# Altium schematic sheet CPLD.SchDoc: {Наименование}
size 420 x 297 mm; DocumentNumber: НРДЦ.ХХХХХХ.ХХХ ХХ; SheetNumber: {}; SheetTotal: {}; PageSetup: Record=PageOptions|CenterHorizontal=False|CenterVertical=False|PrintScale=0.95|XCorrection=0.00|YCorrection=0.00|PrintKind=1|BorderSize=5000000|LeftOffset=0|BottomOffset=0|Orientation=1|PaperLength=1000|PaperWidth=1000|Scale=100|PaperSource=15|PrintQuality=600|MediaType=1|DitherType=10|PaperKind=A4|PrintScaleMode=1; Rule: PcbType=ProtelPcb
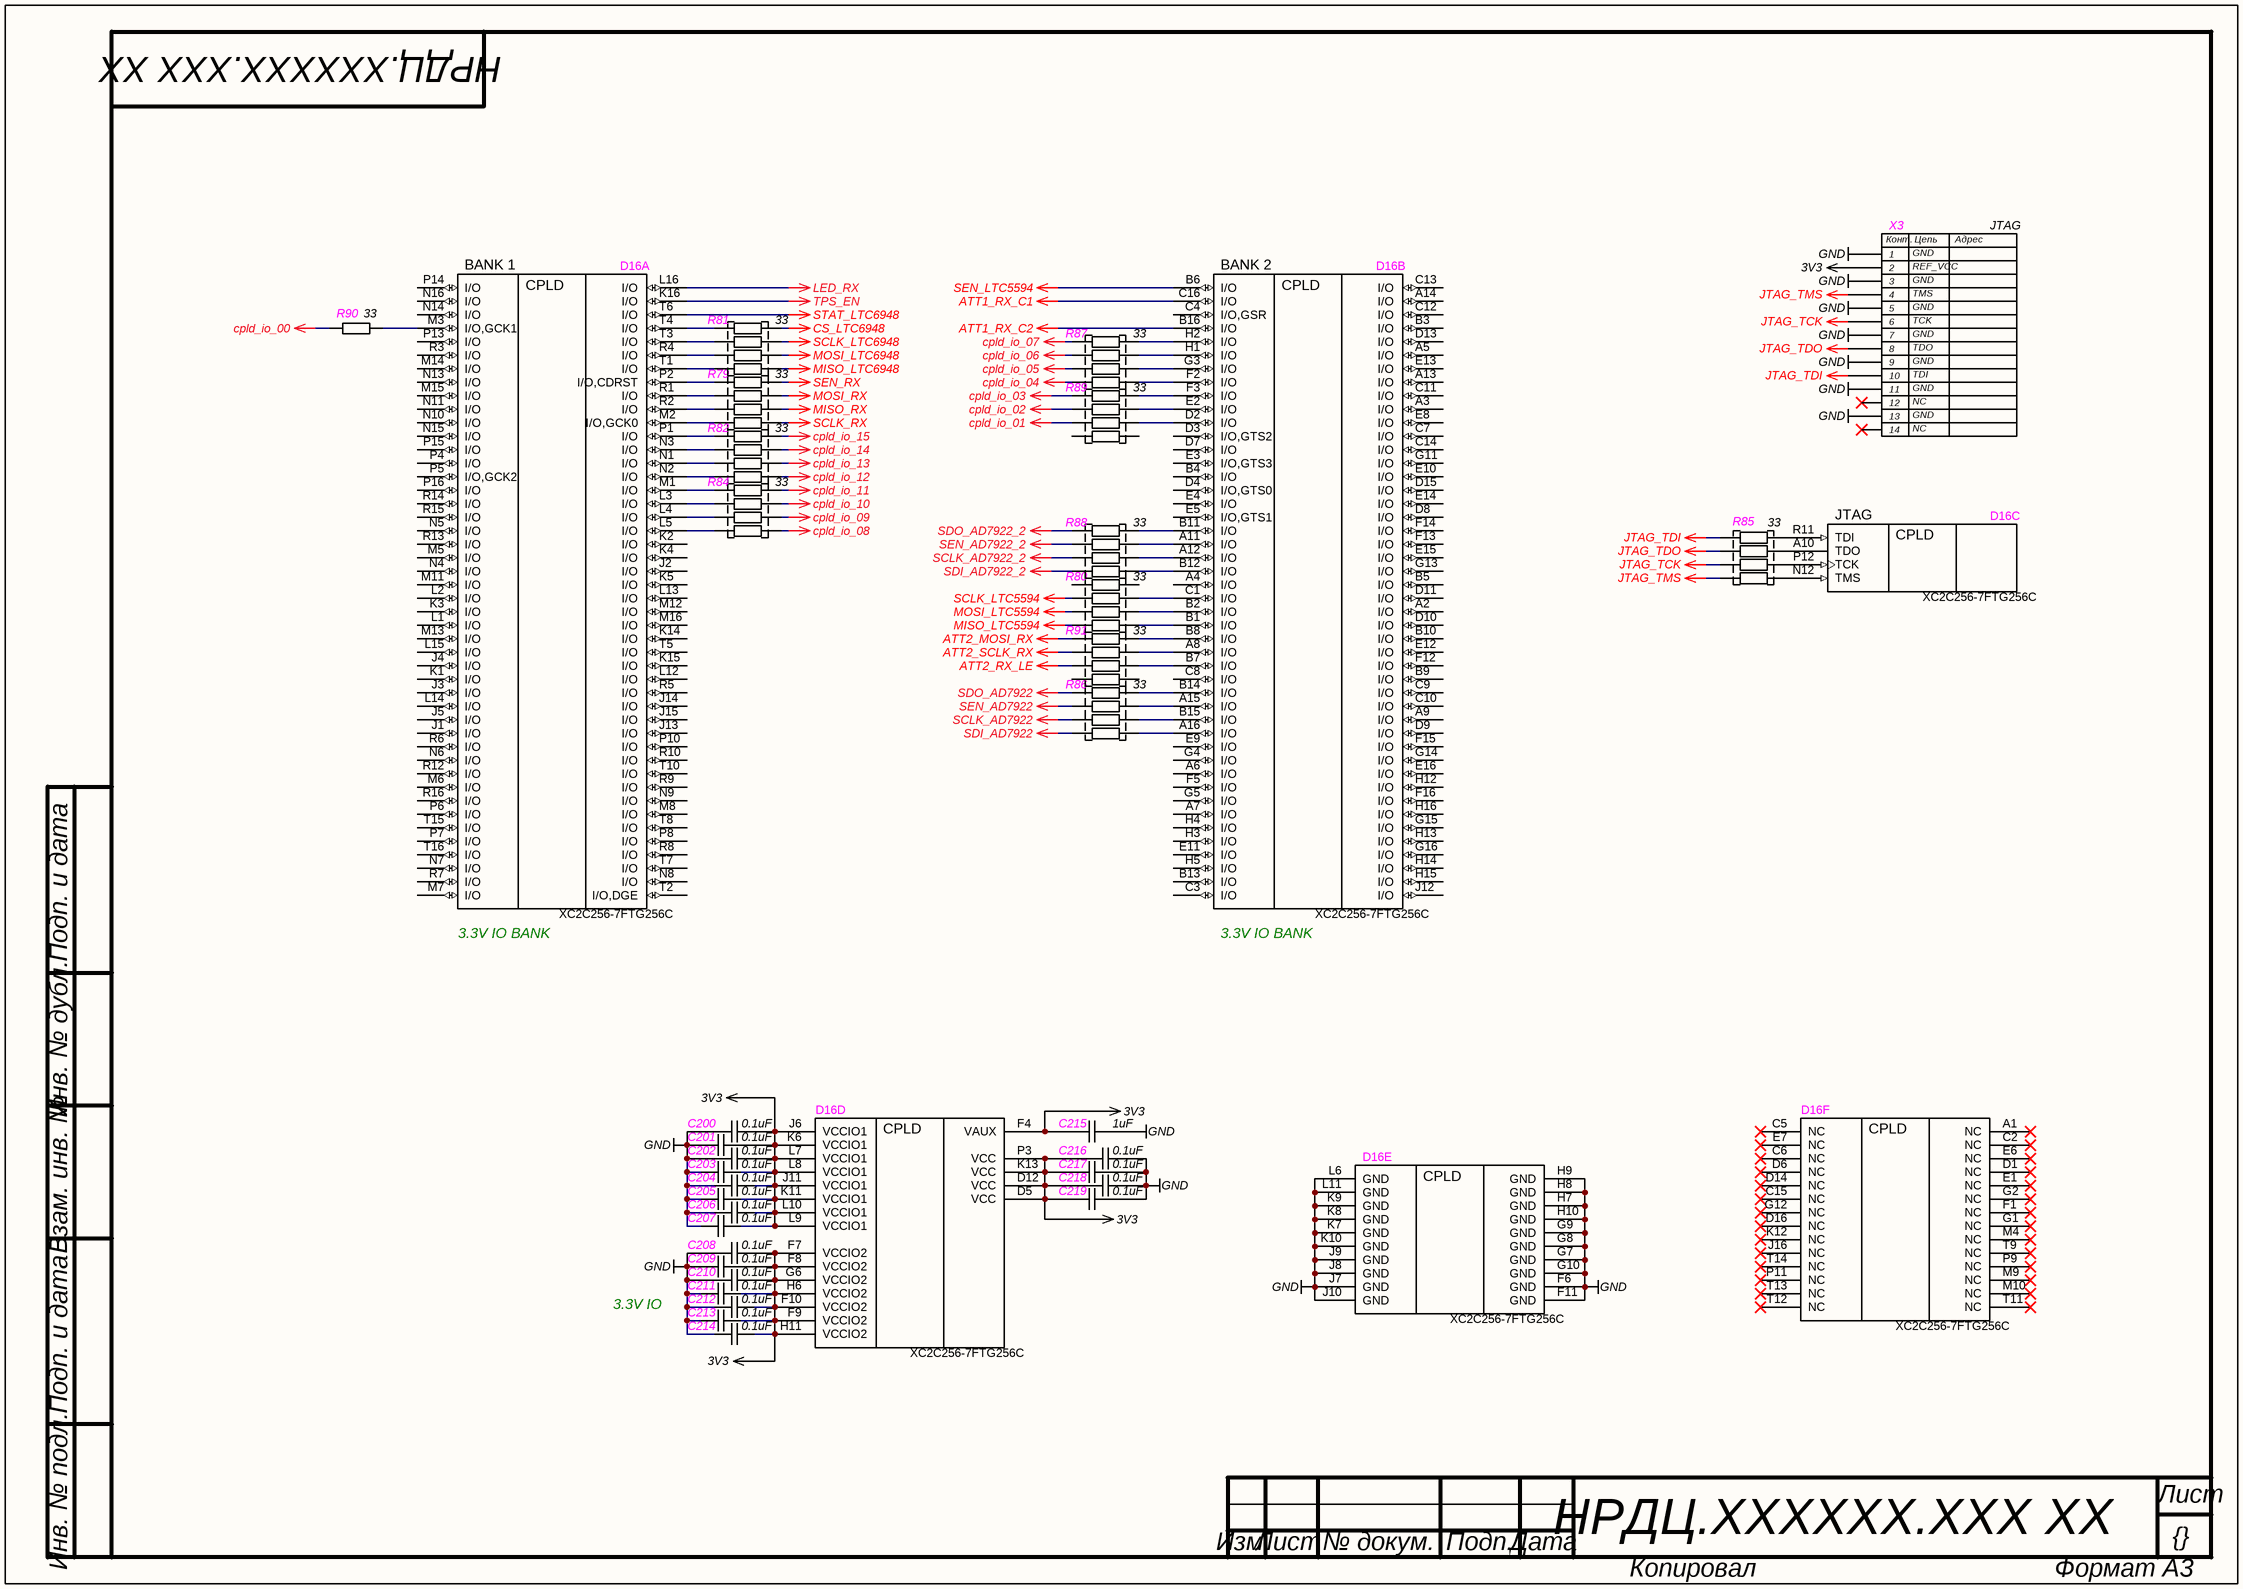
[diagram p0: CPLD.SchDoc]

## Parts
C200  value 0.1uF  [C0402]  (hidden comment: CAP)
C201  value 0.1uF  [C0402]  (hidden comment: CAP)
C202  value 0.1uF  [C0402]  (hidden comment: CAP)
C203  value 0.1uF  [C0402]  (hidden comment: CAP)
C204  value 0.1uF  [C0402]  (hidden comment: CAP)
C205  value 0.1uF  [C0402]  (hidden comment: CAP)
C206  value 0.1uF  [C0402]  (hidden comment: CAP)
C207  value 0.1uF  [C0402]  (hidden comment: CAP)
C208  value 0.1uF  [C0402]  (hidden comment: CAP)
C209  value 0.1uF  [C0402]  (hidden comment: CAP)
C210  value 0.1uF  [C0402]  (hidden comment: CAP)
C211  value 0.1uF  [C0402]  (hidden comment: CAP)
C212  value 0.1uF  [C0402]  (hidden comment: CAP)
C213  value 0.1uF  [C0402]  (hidden comment: CAP)
C214  value 0.1uF  [C0402]  (hidden comment: CAP)
C215  value 1uF  [C0402]  (hidden comment: CAP)
C216  value 0.1uF  [C0402]  (hidden comment: CAP)
C217  value 0.1uF  [C0402]  (hidden comment: CAP)
C218  value 0.1uF  [C0402]  (hidden comment: CAP)
C219  value 0.1uF  [C0402]  (hidden comment: CAP)
D16  XC2C256-7FTG256C  [FTG256]  (parts A,B,C,D,E,F of 6)
R79  value 33  [EXN8V]  (hidden comment: RES 4x0402)
R80  value 33  [EXN8V]  (hidden comment: RES 4x0402)
R81  value 33  [EXN8V]  (hidden comment: RES 4x0402)
R82  value 33  [EXN8V]  (hidden comment: RES 4x0402)
R84  value 33  [EXN8V]  (hidden comment: RES 4x0402)
R85  value 33  [EXN8V]  (hidden comment: RES 4x0402)
R86  value 33  [EXN8V]  (hidden comment: RES 4x0402)
R87  value 33  [EXN8V]  (hidden comment: RES 4x0402)
R88  value 33  [EXN8V]  (hidden comment: RES 4x0402)
R89  value 33  [EXN8V]  (hidden comment: RES 4x0402)
R90  value 33  [R0402]  (hidden comment: RES)
R91  value 33  [EXN8V]  (hidden comment: RES 4x0402)
X3  JTAG  [JTAG Mail 2mm]

## Nets
3V3: C200.2 C201.2 C202.2 C203.2 C204.2 C205.2 C206.2 C207.2 C208.2 C209.2 C210.2 C211.2 C212.2 C213.2 C214.2 C215.1 C216.1 C217.1 C218.1 C219.1 D16.D5(VCC) D16.D12(VCC) D16.F4(VAUX) D16.F7(VCCIO2) D16.F8(VCCIO2) D16.F9(VCCIO2) D16.F10(VCCIO2) D16.G6(VCCIO2) D16.H6(VCCIO2) D16.H11(VCCIO2) D16.J6(VCCIO1) D16.J11(VCCIO1) D16.K6(VCCIO1) D16.K11(VCCIO1) D16.K13(VCC) D16.L7(VCCIO1) D16.L8(VCCIO1) D16.L9(VCCIO1) D16.L10(VCCIO1) D16.P3(VCC) X3.2
ATT1_RX_C1: D16.C16(I/O)
ATT1_RX_C2: D16.B16(I/O)
ATT2_MOSI_RX: R91.5
ATT2_RX_LE: R91.7
ATT2_SCLK_RX: R91.6
cpld_io_00: R90.2
cpld_io_01: R89.6
cpld_io_02: R89.7
cpld_io_03: R89.8
cpld_io_04: R87.5
cpld_io_05: R87.6
cpld_io_06: R87.7
cpld_io_07: R87.8
cpld_io_08: R84.5
cpld_io_09: R84.6
cpld_io_10: R84.7
cpld_io_11: R84.8
cpld_io_12: R82.5
cpld_io_13: R82.6
cpld_io_14: R82.7
cpld_io_15: R82.8
CS_LTC6948: R81.8
GND: C200.1 C201.1 C202.1 C203.1 C204.1 C205.1 C206.1 C207.1 C208.1 C209.1 C210.1 C211.1 C212.1 C213.1 C214.1 C215.2 C216.2 C217.2 C218.2 C219.2 D16.F6(GND) D16.F11(GND) D16.G7(GND) D16.G8(GND) D16.G9(GND) D16.G10(GND) D16.H7(GND) D16.H8(GND) D16.H9(GND) D16.H10(GND) D16.J7(GND) D16.J8(GND) D16.J9(GND) D16.J10(GND) D16.K7(GND) D16.K8(GND) D16.K9(GND) D16.K10(GND) D16.L6(GND) D16.L11(GND) X3.1 X3.3 X3.5 X3.7 X3.9 X3.11 X3.13
JTAG_TCK: R85.6 X3.6
JTAG_TDI: R85.8 X3.10
JTAG_TDO: R85.7 X3.8
JTAG_TMS: R85.5 X3.4
LED_RX: D16.L16(I/O)
MISO_LTC5594: R80.5
MISO_LTC6948: R81.5
MISO_RX: R79.7
MOSI_LTC5594: R80.6
MOSI_LTC6948: R81.6
MOSI_RX: R79.6
SCLK_AD7922: R86.2
SCLK_AD7922_2: R88.6
SCLK_LTC5594: R80.7
SCLK_LTC6948: R81.7
SCLK_RX: R79.8
SDI_AD7922: R86.1
SDI_AD7922_2: R88.5
SDO_AD7922: R86.4
SDO_AD7922_2: R88.8
SEN_AD7922: R86.3
SEN_AD7922_2: R88.7
SEN_LTC5594: D16.B6(I/O)
SEN_RX: R79.5
STAT_LTC6948: D16.T6(I/O)
TPS_EN: D16.K16(I/O)
NetD16_A8: D16.A8(I/O) R91.3
NetD16_A10: D16.A10(TDO) R85.2
NetD16_A11: D16.A11(I/O) R88.1
NetD16_A12: D16.A12(I/O) R88.3
NetD16_A15: D16.A15(I/O) R86.6
NetD16_A16: D16.A16(I/O) R86.8
NetD16_B1: D16.B1(I/O) R80.4
NetD16_B2: D16.B2(I/O) R80.3
NetD16_B7: D16.B7(I/O) R91.2
NetD16_B8: D16.B8(I/O) R91.4
NetD16_B11: D16.B11(I/O) R88.2
NetD16_B12: D16.B12(I/O) R88.4
NetD16_B14: D16.B14(I/O) R86.5
NetD16_B15: D16.B15(I/O) R86.7
NetD16_C1: D16.C1(I/O) R80.2
NetD16_D2: D16.D2(I/O) R89.3
NetD16_E2: D16.E2(I/O) R89.2
NetD16_F2: D16.F2(I/O) R87.4
NetD16_F3: D16.F3(I/O) R89.1
NetD16_G3: D16.G3(I/O) R87.3
NetD16_H1: D16.H1(I/O) R87.2
NetD16_H2: D16.H2(I/O) R87.1
NetD16_L3: D16.L3(I/O) R84.2
NetD16_L4: D16.L4(I/O) R84.3
NetD16_L5: D16.L5(I/O) R84.4
NetD16_M1: D16.M1(I/O) R84.1
NetD16_M2: D16.M2(I/O,GCK0) R79.1
NetD16_M3: D16.M3(I/O,GCK1) R90.1
NetD16_N1: D16.N1(I/O) R82.3
NetD16_N2: D16.N2(I/O) R82.4
NetD16_N3: D16.N3(I/O) R82.2
NetD16_N12: D16.N12(TMS) R85.4
NetD16_P1: D16.P1(I/O) R82.1
NetD16_P2: D16.P2(I/O,CDRST) R79.4
NetD16_P12: D16.P12(TCK) R85.3
NetD16_R1: D16.R1(I/O) R79.3
NetD16_R2: D16.R2(I/O) R79.2
NetD16_R4: D16.R4(I/O) R81.2
NetD16_R11: D16.R11(TDI) R85.1
NetD16_T1: D16.T1(I/O) R81.4
NetD16_T3: D16.T3(I/O) R81.3
NetD16_T4: D16.T4(I/O) R81.1

Not connected (* = marked no-connect by the designer): D16 A1(NC)* A2(I/O) A3(I/O) A4(I/O) A5(I/O) A6(I/O) A7(I/O) A9(I/O) A13(I/O) A14(I/O) B3(I/O) B4(I/O) B5(I/O) B9(I/O) B10(I/O) B13(I/O) C2(NC)* C3(I/O) C4(I/O,GSR) C5(NC)* C6(NC)* C7(I/O) C8(I/O) C9(I/O) C10(I/O) C11(I/O) C12(I/O) C13(I/O) C14(I/O) C15(NC)* D1(NC)* D3(I/O,GTS2) D4(I/O,GTS0) D6(NC)* D7(I/O) D8(I/O) D9(I/O) D10(I/O) D11(I/O) D13(I/O) D14(NC)* D15(I/O) D16(NC)* E1(NC)* E3(I/O,GTS3) E4(I/O) E5(I/O,GTS1) E6(NC)* E7(NC)* E8(I/O) E9(I/O) E10(I/O) E11(I/O) E12(I/O) E13(I/O) E14(I/O) E15(I/O) E16(I/O) F1(NC)* F5(I/O) F12(I/O) F13(I/O) F14(I/O) F15(I/O) F16(I/O) G1(NC)* G2(NC)* G4(I/O) G5(I/O) G11(I/O) G12(NC)* G13(I/O) G14(I/O) G15(I/O) G16(I/O) H3(I/O) H4(I/O) H5(I/O) H12(I/O) H13(I/O) H14(I/O) H15(I/O) H16(I/O) J1(I/O) J2(I/O) J3(I/O) J4(I/O) J5(I/O) J12(I/O) J13(I/O) J14(I/O) J15(I/O) J16(NC)* K1(I/O) K2(I/O) K3(I/O) K4(I/O) K5(I/O) K12(NC)* K14(I/O) K15(I/O) L1(I/O) L2(I/O) L12(I/O) L13(I/O) L14(I/O) L15(I/O) M4(NC)* M5(I/O) M6(I/O) M7(I/O) M8(I/O) M9(NC)* M10(NC)* M11(I/O) M12(I/O) M13(I/O) M14(I/O) M15(I/O) M16(I/O) N4(I/O) N5(I/O) N6(I/O) N7(I/O) N8(I/O) N9(I/O) N10(I/O) N11(I/O) N13(I/O) N14(I/O) N15(I/O) N16(I/O) P4(I/O) P5(I/O,GCK2) P6(I/O) P7(I/O) P8(I/O) P9(NC)* P10(I/O) P11(NC)* P13(I/O) P14(I/O) P15(I/O) P16(I/O) R3(I/O) R5(I/O) R6(I/O) R7(I/O) R8(I/O) R9(I/O) R10(I/O) R12(I/O) R13(I/O) R14(I/O) R15(I/O) R16(I/O) T2(I/O,DGE) T5(I/O) T7(I/O) T8(I/O) T9(NC)* T10(I/O) T11(NC)* T12(NC)* T13(NC)* T14(NC)* T15(I/O) T16(I/O); R80 1 8; R89 4 5; R91 1 8; X3 12* 14*

## Notes on the sheet
- (near X3) GND
- (near X3) REF_VCC
- (near X3) TMS
- (near X3) TCK
- (near X3) TDO
- (near X3) TDI
- (near X3) NC
- (near D16) 3.3V IO BANK
- 3.3V IO
- Подп. и дата
- Инв. № дубл.
- Взам. инв. №
- Инв. № подл.
- Лист
- Изм.
- № докум.
- Подп.
- Дата
- Копировал
- Формат А3
- (in symbol HDR Debug_14-pin) Конт.; Цепь; Адрес
- (in symbol XC2C256-7FTG256C, part A) BANK 1
- (in symbol XC2C256-7FTG256C, part B) BANK 2
- (in symbol XC2C256-7FTG256C, part C) JTAG

## Library data of the parts
C200-C214 C216-C219 = CAP: SMD Capacitor; Manufacturer: Murata; Material: X7R; Tolerance: 10%; Voltage: 10V; Type: Ceramic Capacitor; P/N: GRM155R71A104KA01J; Supplier 1: Digi-key; Supplier Part Number 1: 490-6322-1-ND; Supplier 2: Mouser; Supplier Part Number 2: 81-GRM155R71A104KA1J; Supplier 3: Farnell; Supplier Part Number 3: *
C215 = CAP: SMD Capacitor; Manufacturer: Murata; Material: X7R; Tolerance: 10%; Voltage: 6.3V; Type: Ceramic Capacitor; P/N: GRM155R70J105KA12J; Supplier 1: Digi-key; Supplier Part Number 1: 490-13339-1-ND; Supplier 2: Mouser; Supplier Part Number 2: 81-GRM155R70J105KA2J; Supplier 3: Farnell; Supplier Part Number 3: *
D16 = XC2C256-7FTG256C: CoolRunner-II 1.8V, 256 Macrocell CPLD, 184 User I/Os, 256-Ball FTBGA, Commercial Grade, Pb-Free; Code_JEDEC: MS-034-AAF-1*; PackageVersion: ver1.3, Oct-2007; PackageReference: FTG256; PackageDescription: 256-Ball Fine Pitch Thin Ball Grid Array 1.00 mm Pitch (FTG256) - Pb-Free; DatasheetVersion: ver3.2, Mar-2007; PartNumber: XC2C256-7FTG256C; P/N: XC2C256-7FTG256C; Name: XC2C256-7FTG256C; Type: CPLD; Supplier 1: Digi-key; Supplier Part Number 1: 122-1400-ND; Supplier 2: Mouser; Supplier Part Number 2: 217-XC2C256-7FTG256C; Supplier 3: Farnell; Supplier Part Number 3: *
R79-R82 R84-R89 R91 = RES 4x0402: Chip Resistor Array; Manufacturer: Panasonic; Name: EXBN8V; Number of Resistors: 4; Tolerance: 5%; P/N: EXB-N8V330JX; Type: 0402 Array Concave Terminal; Number of Terminals: 8; Series: EXB; Supplier Part Number 1: Y10330CT-ND; Supplier 2: Mouser; Supplier Part Number 2: 667-EXB-N8V330JX; Supplier 3: Farnell; Supplier Part Number 3: *
  R79 R80 R82 R84-R89 R91: Supplier 1: Digi-key
  R81: Supplier 1: Digi-Key
R90 = RES: SMD Resistor; Name: Chip SMD Resistor; Power: 0.1 Wt; Tolerance: 1%; P/N: ERJ-2RKF33R0X; Temperature Range: -55…155°C; Supplier 1: Digi-key; Supplier Part Number 1: P33.0LCT-ND; Supplier 2: Mouser; Supplier Part Number 2: 667-ERJ-2RKF33R0X; Supplier 3: Farnell; Supplier Part Number 3: *
X3 = HDR Debug_14-pin: 2.00mm Pitch, Milli-Grid PCB Header, Dual Row, Vertical, Through Hole, Shrouded, 14 / Circuits; Manufacturer: Molex; Name: Milli-Grid Connector System; P/N: 878311421; Type: 2.00mm Pitch, Milli-Grid PCB Header, Dual Row, Vertical, Through Hole, Shrouded, 14; Series: 87831; Supplier 1: Digi-key; Supplier Part Number 1: WM4224-ND; Supplier 2: Mouser; Supplier Part Number 2: 538-87831-1421; Supplier 3: Farnell; Supplier Part Number 3: *